# Altium schematic sheet LTC6820.SchDoc: foxBMS BMS-Interface
size A3; DocumentNumber: 3; SheetNumber: 3; SheetTotal: 6; Author: Fraunhofer IISB foxBMS Team; REL-DATE: 2017-05-09; VERSION: 1.1.0; GateName_1: G$1; SymbolName_1: FRAME_B_L; LibraryName: foxBMS_BMS-Master_V1.00_A; DeviceSetName: FRAME_B_L; GateName_2: G$2; SymbolName_2: DOCFIELD; SheetDescription: Two LTC6820 for forward and reverese isoSPI
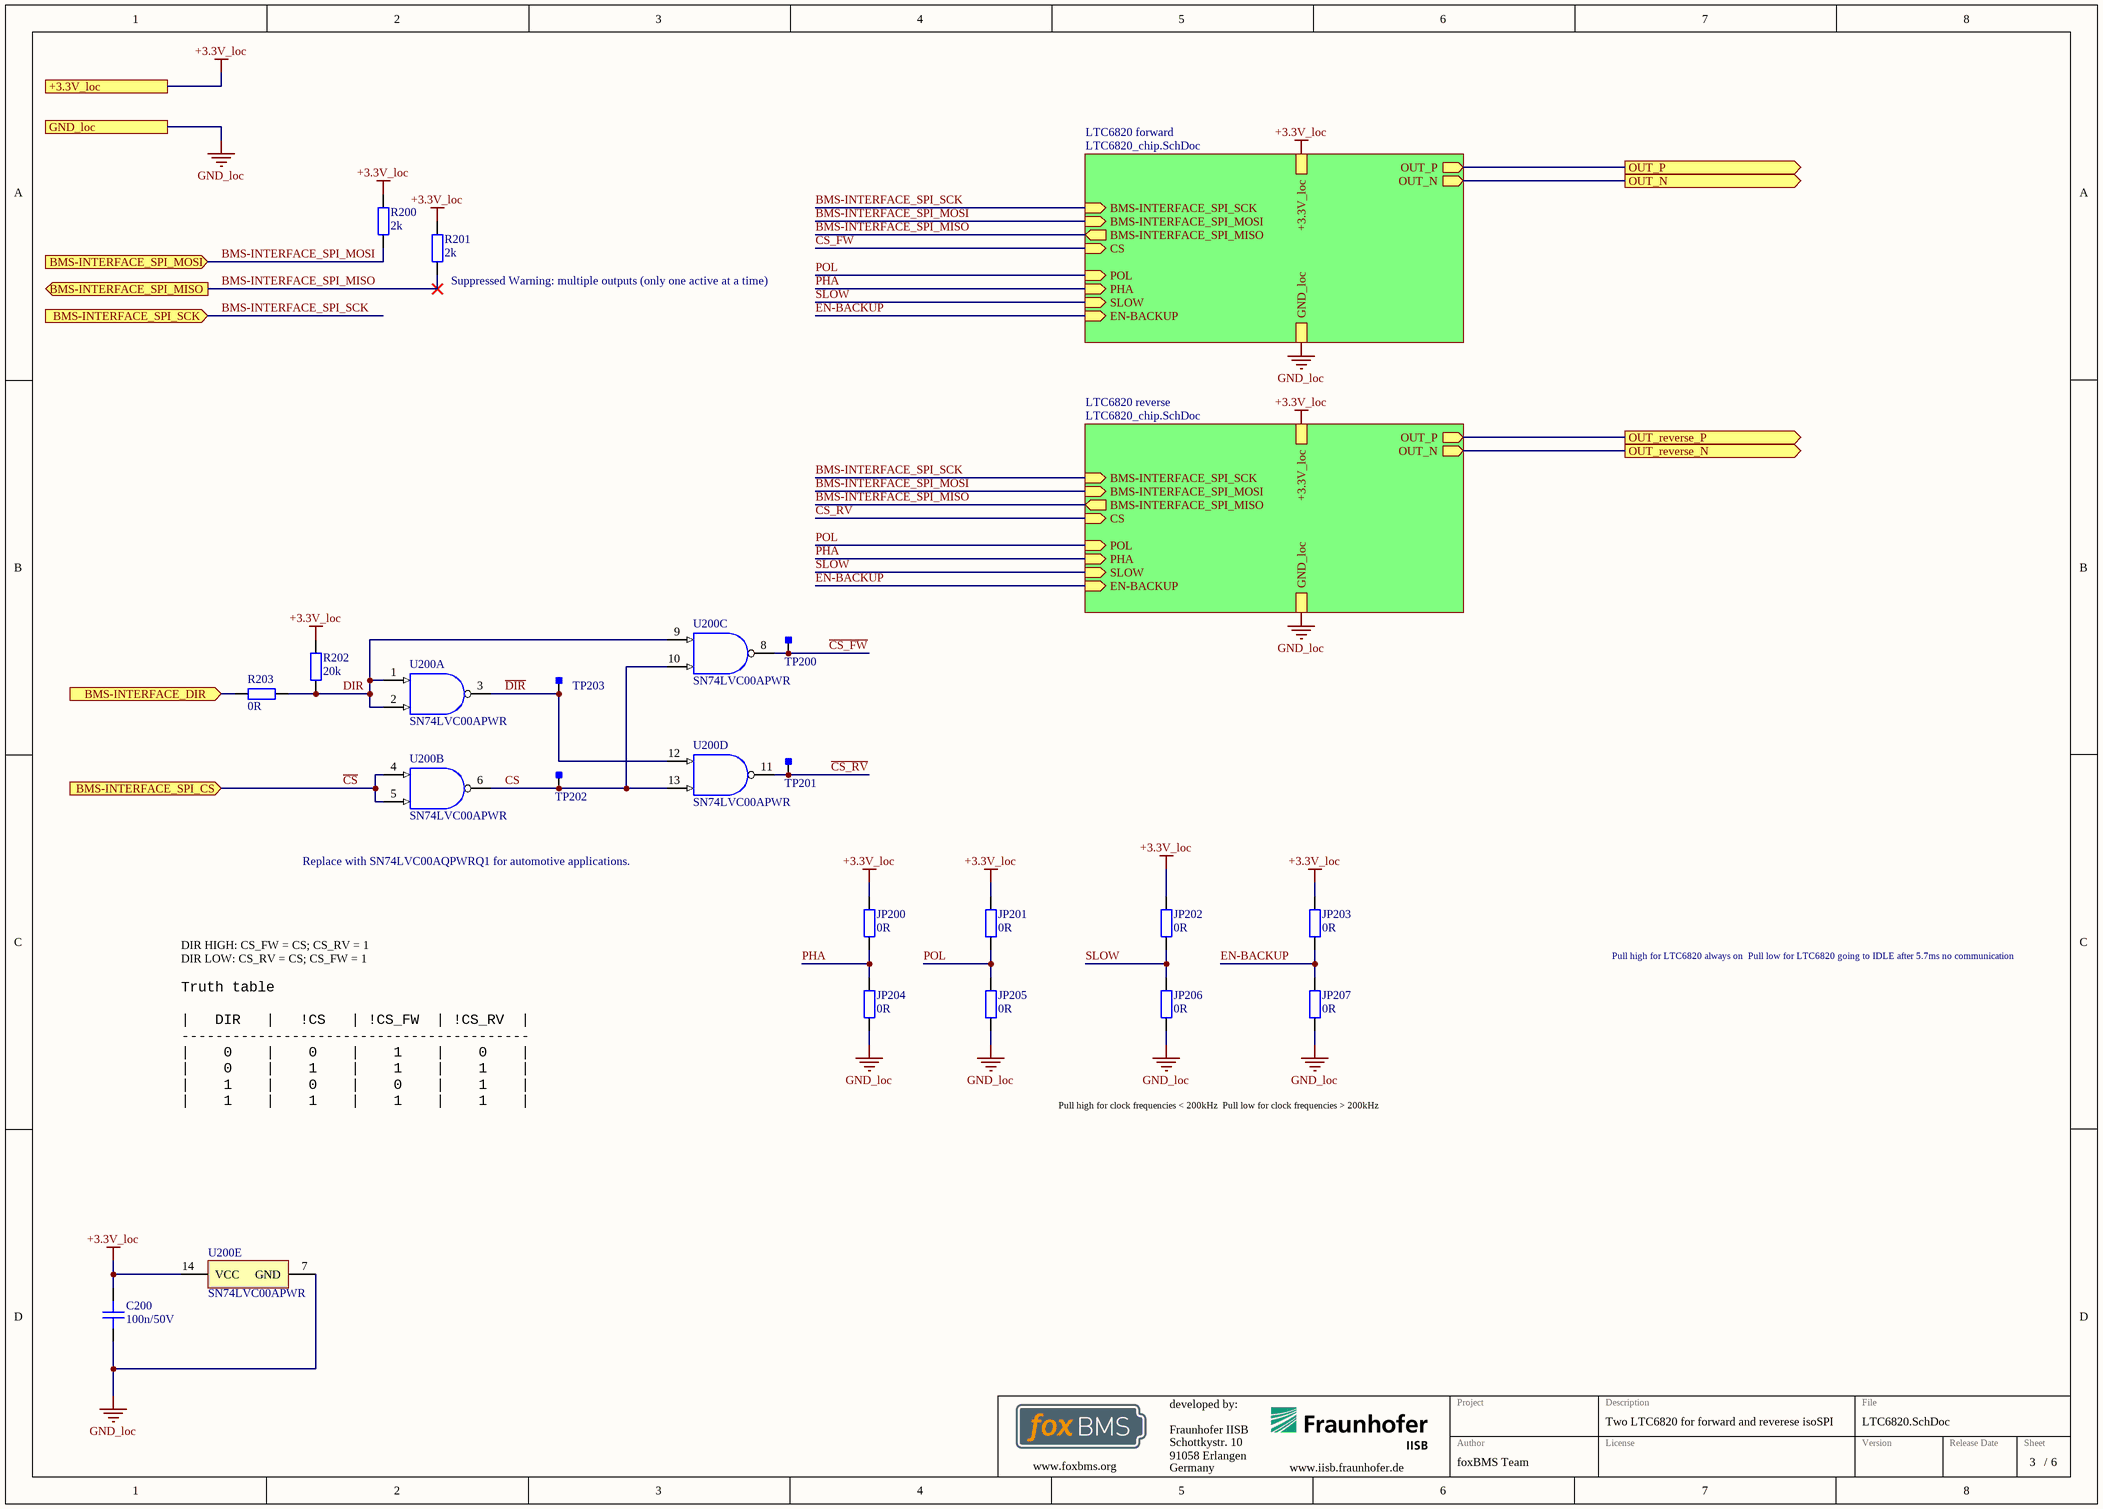
[diagram p0: LTC6820.SchDoc]

## Parts
C200  100n/50V  [CAPC1608X08N]
JP200  0R  [RESC1608X05N]
JP201  0R  [RESC1608X05N]
JP202  0R  [RESC1608X05N]
JP203  0R  [RESC1608X05N]
JP204  0R  [RESC1608X05N]
JP205  0R  [RESC1608X05N]
JP206  0R  [RESC1608X05N]
JP207  0R  [RESC1608X05N]
R200  2k  [RESC1608X05N]
R201  2k  [RESC1608X05N]
R202  20k  [RESC1608X05N]
R203  0R  [RESC1608X05N]
TP200  Testpoint_Square  [Testpoint_S1]  (value not drawn)  (no BOM)
TP201  Testpoint_Square  [Testpoint_S1]  (value not drawn)  (no BOM)
TP202  Testpoint_Square  [Testpoint_S1]  (value not drawn)  (no BOM)
TP203  Testpoint_Square  [Testpoint_S1]  (value not drawn)  (no BOM)
U200  SN74LVC00APWR  [PW0014A_M]  (parts A,B,C,D,E of 5)

## Sub-sheets
LTC6820 forward = LTC6820_chip.SchDoc: OUT_P (out), OUT_N (out), +3.3V_loc, GND_loc, BMS-INTERFACE_SPI_MISO (out), BMS-INTERFACE_SPI_SCK (in), BMS-INTERFACE_SPI_MOSI (in), POL (in), PHA (in), SLOW (in), EN-BACKUP (in), CS (in)
LTC6820 reverse = LTC6820_chip.SchDoc: OUT_P (out), OUT_N (out), +3.3V_loc, GND_loc, BMS-INTERFACE_SPI_MISO (out), BMS-INTERFACE_SPI_SCK (in), BMS-INTERFACE_SPI_MOSI (in), POL (in), PHA (in), SLOW (in), EN-BACKUP (in), CS (in)

## Ports
+3.3V_loc, BMS-INTERFACE_DIR (in), BMS-INTERFACE_SPI_CS (in), BMS-INTERFACE_SPI_MISO (out), BMS-INTERFACE_SPI_MOSI (in), BMS-INTERFACE_SPI_SCK (in), GND_loc, OUT_N (out), OUT_P (out), OUT_reverse_N (out), OUT_reverse_P (out)

## Nets
+3.3V_loc: C200.2 JP200.2 JP201.2 JP202.2 JP203.2 R200.2 R201.2 R202.2 U200.14(VCC) ; port +3.3V_loc, sheet LTC6820 forward/+3.3V_loc, sheet LTC6820 reverse/+3.3V_loc
GND_loc: C200.1 JP204.1 JP205.1 JP206.1 JP207.1 U200.7(GND) ; port GND_loc, sheet LTC6820 forward/GND_loc, sheet LTC6820 reverse/GND_loc
BMS-INTERFACE_DIR: R203.1 ; port BMS-INTERFACE_DIR
BMS-INTERFACE_SPI_MISO: R201.1 ; port BMS-INTERFACE_SPI_MISO, sheet LTC6820 forward/BMS-INTERFACE_SPI_MISO, sheet LTC6820 reverse/BMS-INTERFACE_SPI_MISO
BMS-INTERFACE_SPI_MOSI: R200.1 ; port BMS-INTERFACE_SPI_MOSI, sheet LTC6820 forward/BMS-INTERFACE_SPI_MOSI, sheet LTC6820 reverse/BMS-INTERFACE_SPI_MOSI
BMS-INTERFACE_SPI_SCK: port BMS-INTERFACE_SPI_SCK, sheet LTC6820 forward/BMS-INTERFACE_SPI_SCK, sheet LTC6820 reverse/BMS-INTERFACE_SPI_SCK
~{CS}: U200.4(2A) U200.5(2B) ; port BMS-INTERFACE_SPI_CS
~{CS_FW}: TP200.1 U200.8(3Y) ; sheet LTC6820 forward/CS
~{CS_RV}: TP201.1 U200.11(4Y) ; sheet LTC6820 reverse/CS
CS: TP202.1 U200.6(2Y) U200.10(3B) U200.13(4B)
~{DIR}: TP203.1 U200.3(1Y) U200.12(4A)
DIR: R202.1 R203.2 U200.1(1A) U200.2(1B) U200.9(3A)
EN-BACKUP: JP203.1 JP207.2 ; sheet LTC6820 forward/EN-BACKUP, sheet LTC6820 reverse/EN-BACKUP
OUT_N: port OUT_N, sheet LTC6820 forward/OUT_N
OUT_P: port OUT_P, sheet LTC6820 forward/OUT_P
OUT_reverse_N: port OUT_reverse_N, sheet LTC6820 reverse/OUT_N
OUT_reverse_P: port OUT_reverse_P, sheet LTC6820 reverse/OUT_P
PHA: JP200.1 JP204.2 ; sheet LTC6820 forward/PHA, sheet LTC6820 reverse/PHA
POL: JP201.1 JP205.2 ; sheet LTC6820 forward/POL, sheet LTC6820 reverse/POL
SLOW: JP202.1 JP206.2 ; sheet LTC6820 forward/SLOW, sheet LTC6820 reverse/SLOW

## Notes on the sheet
- (near R201) Suppressed Warning: multiple outputs (only one active at a time)
- Replace with SN74LVC00AQPWRQ1 for automotive applications.
- DIR HIGH: CS_FW = CS; CS_RV = 1
  DIR LOW: CS_RV = CS; CS_FW = 1
- Pull high for LTC6820 always on
  Pull low for LTC6820 going to IDLE after 5.7ms no communication
- Truth table
  |   DIR   |   !CS   | !CS_FW  | !CS_RV  |
  -----------------------------------------
  |    0    |    0    |    1    |    0    |
  |    0    |    1    |    1    |    1    |
  |    1    |    0    |    0    |    1    |
  |    1    |    1    |    1    |    1    |
- Pull high for clock frequencies < 200kHz
  Pull low for clock frequencies > 200kHz
- Fraunhofer IISB
- Schottkystr. 10
- developed by:
- 91058 Erlangen
- Germany
- Author
- Project
- License
- Description
- File
- Version
- Release Date
- Sheet
- www.foxbms.org
- www.iisb.fraunhofer.de
- foxBMS Team
- /

## Library data of the parts
C200 = gen_C_ceramic_100n_50V_X7R_0603: MLCC; Capacitance: 100n; Rated Voltage: 50V; Dielectric: X7R; Case EIA: 0603; Case Metric: 1608; PnP Package: C_0603_10; PnP Value: 100n/50V/X7R; PnP equipped: x; Automotive Qualified: True; Part Number: gen_C_ceramic_100n_50V_X7R_0603; Supplier 1: Farnell; Supplier Part Number 1: 2525267; Supplier 2: Digikey; Supplier Part Number 2: 490-6049-1-ND; Supplier 3: Farnell; Supplier Part Number 3: 2070398
JP200-JP207 R203 = gen_R_0R_0603: SMD Resistor 0R 0603; Power: 0.1W; Case EIA: 0603; Case Metric: 1608; Maximum Working Voltage: 75V; PnP Package: R_0603; Automotive Qualified: True; Part Number: gen_R_0R_0603; Operating Temperature: -55°C - +155°C; Resistance: 0R; Series: Jumper; PnP Value: 0R; Supplier 1: Farnell; Supplier Part Number 1: 2616580
R200 R201 = gen_R_2k_0603: SMD Resistor 2k 0603; Tolerance: 1%; Power: 0.1W; Case EIA: 0603; Case Metric: 1608; Maximum Working Voltage: 75V; PnP Package: R_0603; Automotive Qualified: True; Part Number: gen_R_2k_0603; Operating Temperature: -55°C - +155°C; Resistance: 2k; Series: E24, E96; PnP Value: 2k; Supplier 1: Farnell; Supplier Part Number 1: 2059343
R202 = gen_R_20k_0603: SMD Resistor 20k 0603; Tolerance: 1%; Power: 0.1W; Case EIA: 0603; Case Metric: 1608; Maximum Working Voltage: 75V; PnP Package: R_0603; Automotive Qualified: True; Part Number: gen_R_20k_0603; Operating Temperature: -55°C - +155°C; Resistance: 20k; Series: E24, E96; PnP Value: 20k; Supplier 1: Farnell; Supplier Part Number 1: 2059432
TP200-TP203 = Testpoint_Square: Testpoint, square; Part Number: Testpoint_Square
U200 = CMP-1627-00586-2: Quadruple 2-Input Positive-NAND Gate, PW0014A, LARGE T&R; Manufacturer: Texas Instruments; Rating: Catalog; Voltage(Nom)(V): 1.8,2.5,2.7,3.3; F @ Nom Voltage(Max)(Mhz): 150; VCC(Min)(V): 1.65; Input Type: TTL; VCC(Max)(V): 3.6; Technology Family: LVC; Output Drive (IOL/IOH)(Max)(mA): 24/-24; ICC @ Nom Voltage(Max)(mA): 0.04; Schmitt Trigger: No; tpd @ Nom Voltage(Max)(ns): 12.5,6.4,5.1,4.3; DatasheetVersion: SCAS279Q; Generic Part Number: SN74LVC00A; Code_JEDEC: MO-153; Operating Temperature Range(C): -40 to 125; Output Type: TTL; PackageReference: PW0014A